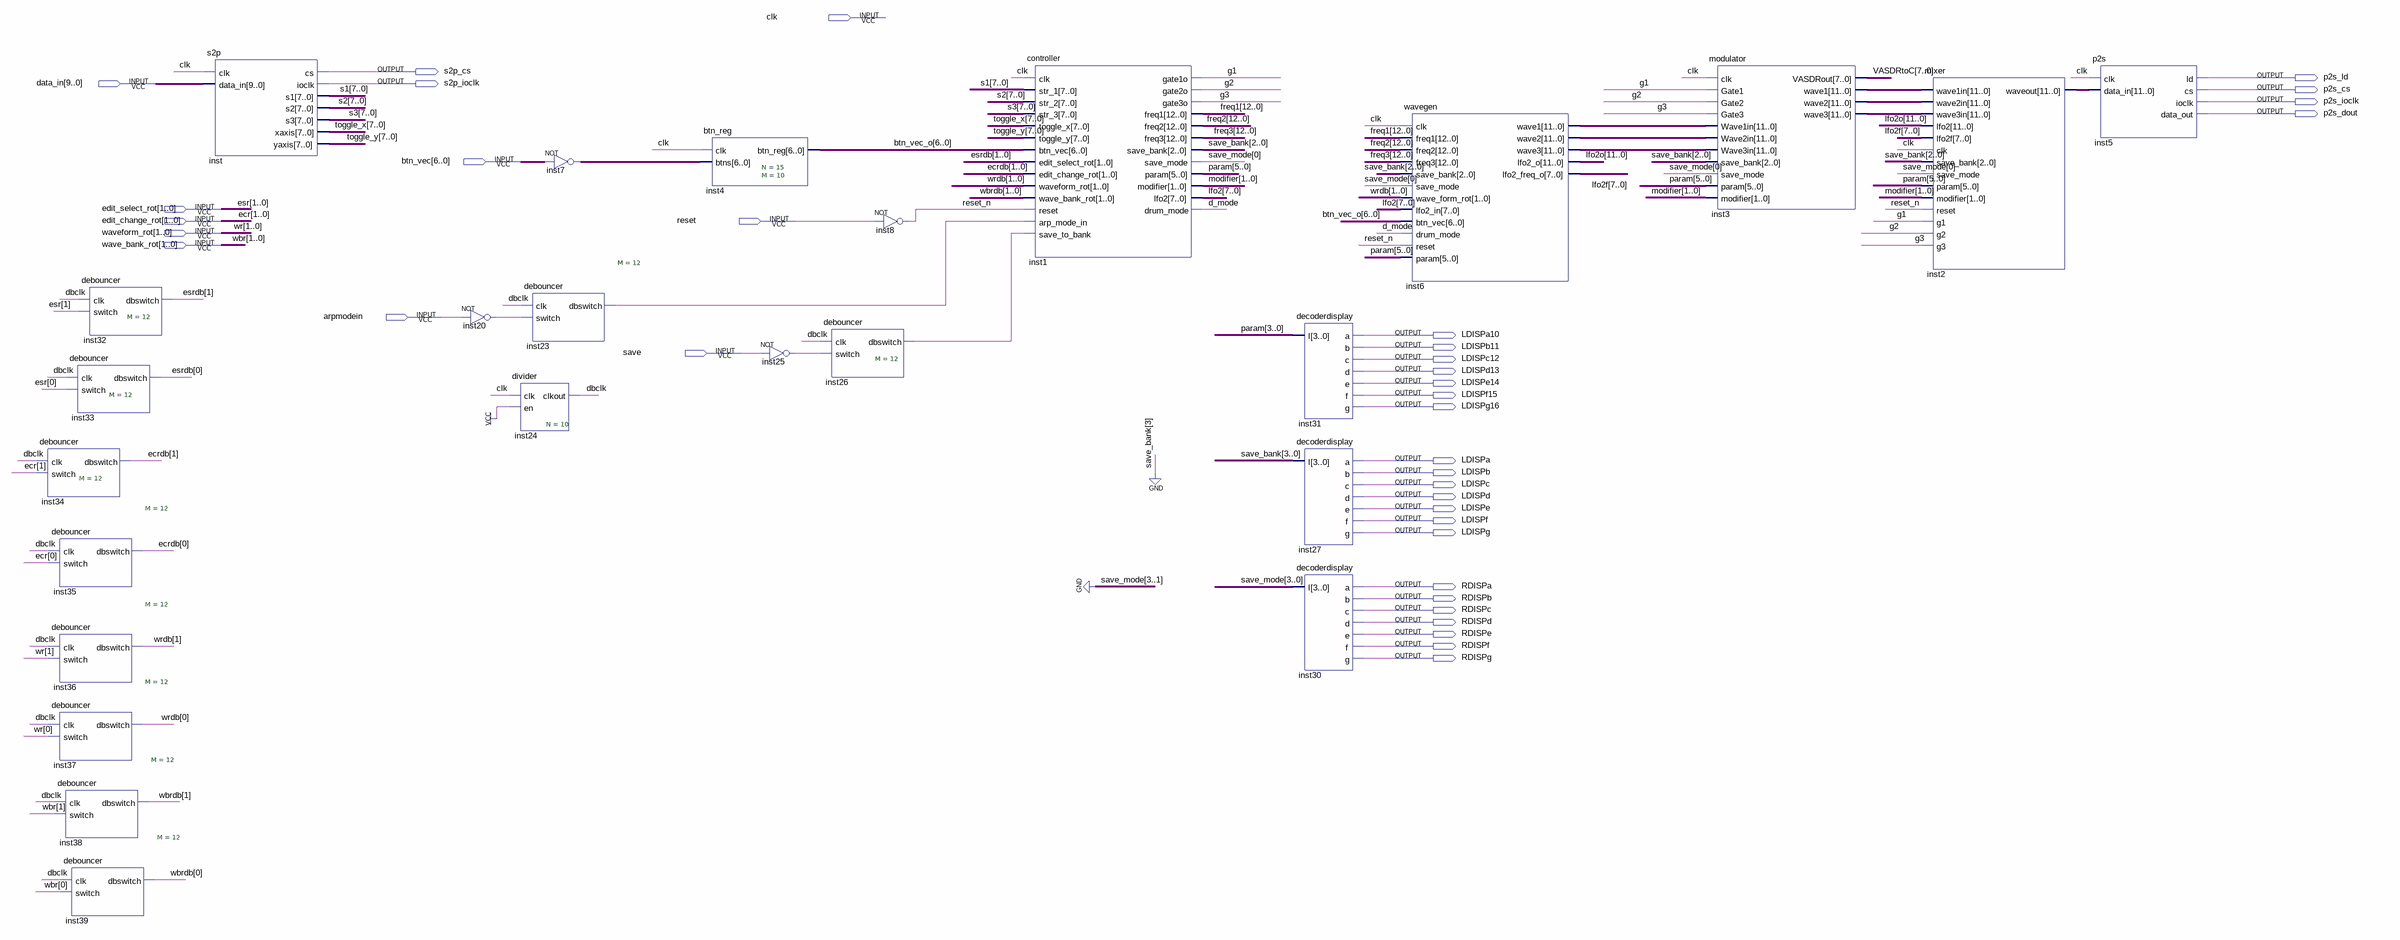
[diagram p0: schematic sheet]
// Quartus schematic 8bitbrain.bdf as structural Verilog: 25 symbols, 37 pins
module \8bitbrain  (
  input  clk,
  input  [9:0] data_in,
  input  [6:0] btn_vec,
  input  [1:0] edit_select_rot,
  input  [1:0] edit_change_rot,
  input  reset,
  input  [1:0] waveform_rot,
  input  [1:0] wave_bank_rot,
  input  arpmodein,
  input  save,
  output s2p_cs,
  output p2s_ld,
  output s2p_ioclk,
  output p2s_cs,
  output p2s_ioclk,
  output p2s_dout,
  output LDISPa10,
  output LDISPb11,
  output LDISPc12,
  output LDISPd13,
  output LDISPe14,
  output LDISPf15,
  output LDISPg16,
  output LDISPa,
  output LDISPb,
  output LDISPc,
  output LDISPd,
  output LDISPe,
  output LDISPf,
  output LDISPg,
  output RDISPa,
  output RDISPb,
  output RDISPc,
  output RDISPd,
  output RDISPe,
  output RDISPf,
  output RDISPg
);

  wire d_mode, dbclk, g1, g2, g3, inst20_out, inst23_dbswitch, inst25_out, inst26_dbswitch, reset_n;
  wire [0:0] save_mode;
  wire [1:0] ecrdb, esrdb, modifier, wbrdb, wrdb;
  wire [2:0] save_bank;
  wire [5:0] param;
  wire [6:0] btn_vec_o, inst7_out;
  wire [7:0] lfo2, lfo2f, s1, s2, s3, toggle_x, toggle_y, VASDRtoC;
  wire [11:0] inst2_waveout, inst3_wave1, inst3_wave2, inst3_wave3, inst6_wave1, inst6_wave2, inst6_wave3,
       lfo2o;
  wire [12:0] freq1, freq2, freq3;

  debouncer #(.M(12)) inst34 (.clk(dbclk), .switch(edit_change_rot[1]), .dbswitch(ecrdb[1]));
  debouncer #(.M(12)) inst35 (.clk(dbclk), .switch(edit_change_rot[0]), .dbswitch(ecrdb[0]));
  debouncer #(.M(12)) inst36 (.clk(dbclk), .switch(waveform_rot[1]), .dbswitch(wrdb[1]));
  debouncer #(.M(12)) inst37 (.clk(dbclk), .switch(waveform_rot[0]), .dbswitch(wrdb[0]));
  debouncer #(.M(12)) inst38 (.clk(dbclk), .switch(wave_bank_rot[1]), .dbswitch(wbrdb[1]));
  debouncer #(.M(12)) inst39 (.clk(dbclk), .switch(wave_bank_rot[0]), .dbswitch(wbrdb[0]));
  debouncer #(.M(12)) inst32 (.clk(dbclk), .switch(edit_select_rot[1]), .dbswitch(esrdb[1]));
  debouncer #(.M(12)) inst33 (.clk(dbclk), .switch(edit_select_rot[0]), .dbswitch(esrdb[0]));
  s2p inst (
    .clk(clk), .data_in(data_in), .cs(s2p_cs), .ioclk(s2p_ioclk), .s1(s1), .s2(s2), .s3(s3),
    .xaxis(toggle_x), .yaxis(toggle_y));
  not inst20 (inst20_out, arpmodein);
  debouncer #(.M(12)) inst23 (.clk(dbclk), .switch(inst20_out), .dbswitch(inst23_dbswitch));
  divider #(.N(10)) inst24 (.clk(clk), .en(1'b1), .clkout(dbclk));
  assign inst7_out = ~btn_vec;  // NOT inst7, 7 bits wide
  btn_reg #(.N(15), .M(10)) inst4 (.clk(clk), .btns(inst7_out), .btn_reg(btn_vec_o));
  not inst25 (inst25_out, save);
  debouncer #(.M(12)) inst26 (.clk(dbclk), .switch(inst25_out), .dbswitch(inst26_dbswitch));
  not inst8 (reset_n, reset);
  controller inst1 (
    .clk(clk), .str_1(s1), .str_2(s2), .str_3(s3), .toggle_x(toggle_x), .toggle_y(toggle_y),
    .btn_vec(btn_vec_o), .edit_select_rot(esrdb), .edit_change_rot(ecrdb), .waveform_rot(wrdb),
    .wave_bank_rot(wbrdb), .reset(reset_n), .arp_mode_in(inst23_dbswitch), .save_to_bank(inst26_dbswitch),
    .gate1o(g1), .gate2o(g2), .gate3o(g3), .freq1(freq1), .freq2(freq2), .freq3(freq3),
    .save_bank(save_bank), .save_mode(save_mode[0]), .param(param), .modifier(modifier), .lfo2(lfo2),
    .drum_mode(d_mode));
  decoderdisplay inst31 (
    .I(param[3:0]), .a(LDISPa10), .b(LDISPb11), .c(LDISPc12), .d(LDISPd13), .e(LDISPe14), .f(LDISPf15),
    .g(LDISPg16));
  decoderdisplay inst27 (
    .I({1'b0, save_bank}), .a(LDISPa), .b(LDISPb), .c(LDISPc), .d(LDISPd), .e(LDISPe), .f(LDISPf), .g(LDISPg));
  decoderdisplay inst30 (
    .I({3'b000, save_mode[0]}), .a(RDISPa), .b(RDISPb), .c(RDISPc), .d(RDISPd), .e(RDISPe), .f(RDISPf),
    .g(RDISPg));
  wavegen inst6 (
    .clk(clk), .freq1(freq1), .freq2(freq2), .freq3(freq3), .save_bank(save_bank), .save_mode(save_mode[0]),
    .wave_form_rot(wrdb), .lfo2_in(lfo2), .btn_vec(btn_vec_o), .drum_mode(d_mode), .reset(reset_n),
    .param(param), .wave1(inst6_wave1), .wave2(inst6_wave2), .wave3(inst6_wave3), .lfo2_o(lfo2o),
    .lfo2_freq_o(lfo2f));
  modulator inst3 (
    .clk(clk), .Gate1(g1), .Gate2(g2), .Gate3(g3), .Wave1in(inst6_wave1), .Wave2in(inst6_wave2),
    .Wave3in(inst6_wave3), .save_bank(save_bank), .save_mode(save_mode[0]), .param(param),
    .modifier(modifier), .VASDRout(VASDRtoC), .wave1(inst3_wave1), .wave2(inst3_wave2), .wave3(inst3_wave3));
  mixer inst2 (
    .wave1in(inst3_wave1), .wave2in(inst3_wave2), .wave3in(inst3_wave3), .lfo2(lfo2o), .lfo2f(lfo2f),
    .clk(clk), .save_bank(save_bank), .save_mode(save_mode[0]), .param(param), .modifier(modifier),
    .reset(reset_n), .g1(g1), .g2(g2), .g3(g3), .waveout(inst2_waveout));
  p2s inst5 (.clk(clk), .data_in(inst2_waveout), .ld(p2s_ld), .cs(p2s_cs), .ioclk(p2s_ioclk), .data_out(p2s_dout));

  // Other names for the same wires on the sheet: ecr[1:0] = edit_change_rot; esr[1:0] = edit_select_rot;
  //   wbr[1:0] = wave_bank_rot; wr[1:0] = waveform_rot
endmodule
